# EAGLE design layout_2layers (EAGLE 7.7.0)
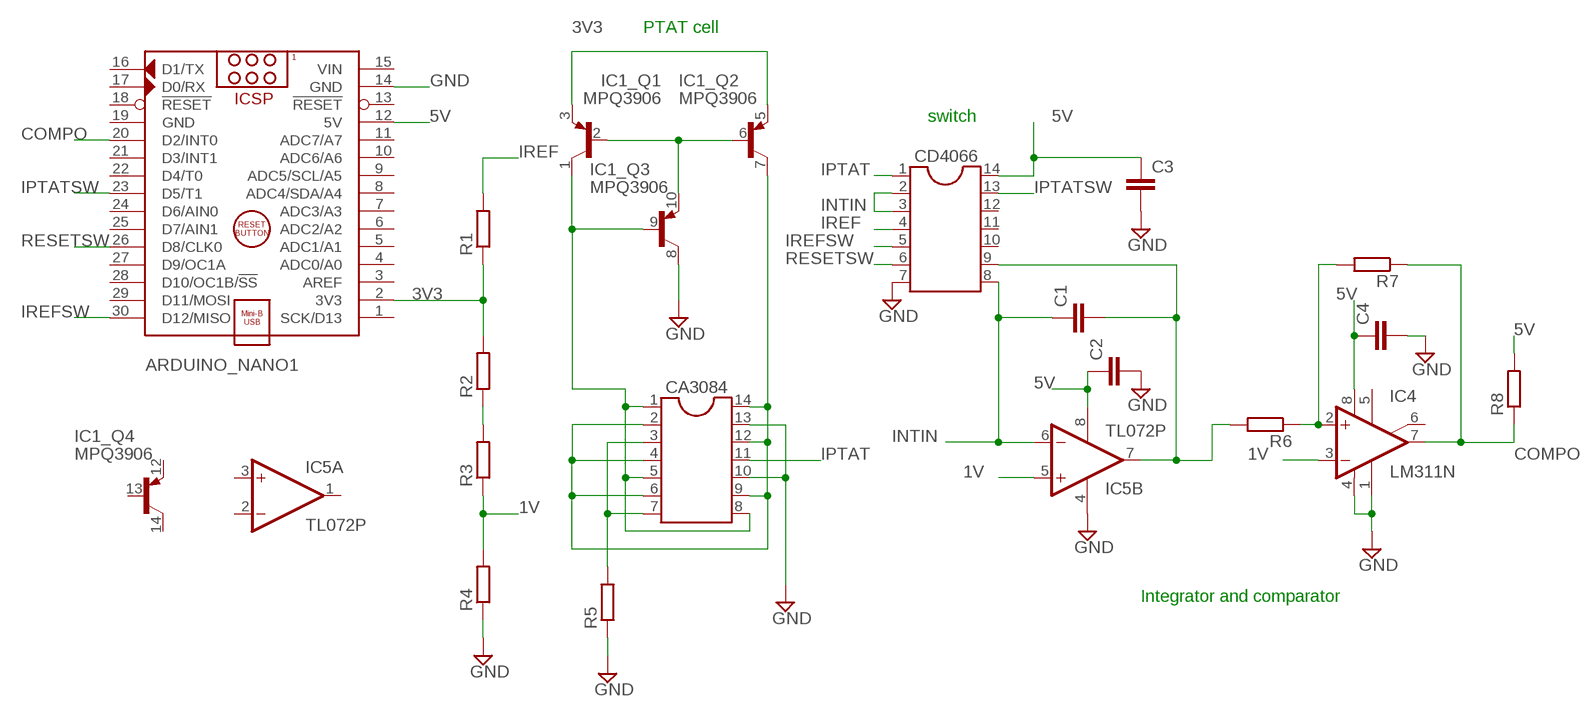
[diagram p0: schematic, sheet 1]

## Parts
ARDUINO_NANO1  ARDUINO_NANO  [ARDUINO_NANO]
C1  C-EU050-025X075  [C050-025X075]
C2  C-EU050-025X075  [C050-025X075]
C3  C-EU050-025X075  [C050-025X075]
C4  C-EU050-025X075  [C050-025X075]
CA3084  DIL14S  [SOCKET-14]
CD4066  DIL14S  [SOCKET-14]
IC1  MPQ3906  [DIL14]
IC4  LM311N  [DIL08]
IC5  TL072P  [DIL08]
R1  R-EU_0207/10  [0207/10]
R2  R-EU_0207/10  [0207/10]
R3  R-EU_0207/10  [0207/10]
R4  R-EU_0207/10  [0207/10]
R5  R-EU_0207/10  [0207/10]
R6  R-EU_0207/10  [0207/10]
R7  R-EU_0207/10  [0207/10]
R8  R-EU_0207/10  [0207/10]

## Nets
1V: IC4.3(-IN) IC5.5(B:+IN) R3.1 R4.2
3V3: ARDUINO_NANO1.2(3V3) IC1.3(_Q1:E) IC1.5(_Q2:E) R1.1 R2.2
5V: ARDUINO_NANO1.12(5V) C2.1 C3.1 C4.1 CD4066.14 IC4.8(V+) IC5.8(P:V+) R8.2
COMPO: ARDUINO_NANO1.20(D2/INT0) IC4.7(OUT) R7.1 R8.1
GND: ARDUINO_NANO1.14(GND) C2.2 C3.2 C4.2 CA3084.10 CA3084.13 CD4066.7 IC1.8(_Q3:C) IC4.1(GND) IC4.4(V-) IC5.4(P:V-) R4.1 R5.1
INTIN: C1.1 CD4066.2 CD4066.3 CD4066.8 IC5.6(B:-IN)
IPTAT: CA3084.11 CD4066.1
IPTATSW: ARDUINO_NANO1.23(D5/T1) CD4066.13
IREF: CD4066.4 R1.2
IREFSW: ARDUINO_NANO1.30(D12/MISO) CD4066.5
N$1: CA3084.3 CA3084.7 R5.2
N$2: CA3084.2 CA3084.4 CA3084.6 CA3084.9 CA3084.12 CA3084.14 IC1.7(_Q2:C)
N$3: IC4.2(+IN) R6.1 R7.2
N$5: R2.1 R3.2
N$7: IC1.2(_Q1:B) IC1.6(_Q2:B) IC1.10(_Q3:E)
N$12: CA3084.1 CA3084.5 CA3084.8 IC1.1(_Q1:C) IC1.9(_Q3:B)
RESET2: C1.2 CD4066.9 IC5.7(B:OUT) R6.2
RESETSW: ARDUINO_NANO1.26(D8/CLK0) CD4066.6
Unconnected: ARDUINO_NANO1.1(SCK/D13) ARDUINO_NANO1.3(AREF) ARDUINO_NANO1.4(ADC0/A0) ARDUINO_NANO1.5(ADC1/A1) ARDUINO_NANO1.6(ADC2/A2) ARDUINO_NANO1.7(ADC3/A3) ARDUINO_NANO1.8(ADC4/SDA/A4) ARDUINO_NANO1.9(ADC5/SCL/A5) ARDUINO_NANO1.10(ADC6/A6) ARDUINO_NANO1.11(ADC7/A7) ARDUINO_NANO1.13(!RESET) ARDUINO_NANO1.16(D1/TX) ARDUINO_NANO1.17(D0/RX) ARDUINO_NANO1.18(!RESET) ARDUINO_NANO1.21(D3/INT1) ARDUINO_NANO1.22(D4/T0) ARDUINO_NANO1.24(D6/AIN0) ARDUINO_NANO1.25(D7/AIN1) ARDUINO_NANO1.27(D9/OC1A) ARDUINO_NANO1.28(D10/OC1B/!SS) ARDUINO_NANO1.29(D11/MOSI) CD4066.10 CD4066.11 CD4066.12 IC1.12(_Q4:E) IC1.13(_Q4:B) IC1.14(_Q4:C) IC4.5(ON) IC4.6(ON/STR) IC5.1(A:OUT) IC5.2(A:-IN) IC5.3(A:+IN)

## Notes on the sheet
- PTAT cell
- switch
- Integrator and comparator

## Power pins joined to a net without a drawn wire
GND: ARDUINO_NANO1.19(GND)
VIN: ARDUINO_NANO1.15(VIN)

## Library data of the parts
ARDUINO_NANO1 = 6301-temp-sensor-rev1:ARDUINO_NANO: Arduino Nano V3.0 Module Overview: The Arduino Nano is a small, complete, and breadboard-friendly board based on the ATmega328 (Arduino Nano 3.x) or ATmega168 (Arduino Nano 2.x). It has more or less the same functionality of the Arduino Duemilanove, but in a different package. It lacks only a DC power jack, and works with a Mini-B USB cable instead of a standard one. The Nano was designed and is being produced by Gravitech <http://www.gravitech.us/arna30wiatp.html>. General specifications: Item Value Microcontroller Atmel ATmega168 or ATmega328 Operating Voltage (logic level) 5 V Input Voltage (recommended) 7-12 V Input Voltage (limits) 6-20 V Digital I/O Pins 14 (of which 6 provide PWM output) Analog Input Pins 8 DC Current per I/O Pin 40 mA Flash Memory 16 KB (ATmega168) or 32 KB (ATmega328) of which 2 KB used by bootloader SRAM 1 KB (ATmega168) or 2 KB (ATmega328) EEPROM 512 bytes (ATmega168) or 1 KB (ATmega328) Clock Speed 16 MHz Dimensions (Inches) 0.73" x 1.70" Dimensions (mm) 18mm x 45mm Overall height About 9 mm (not including pins) Weigth 5 g Power: The Arduino Nano can be powered via the Mini-B USB connection, 6-20V unregulated external power supply (pin 30), or 5V regulated external power supply (pin 27). The power source is automatically selected to the highest voltage source. Memory: The ATmega168 has 16 KB of flash memory for storing code (of which 2 KB is used for the bootloader); the ATmega328 has 32 KB, (also with 2 KB used for the bootloader). The ATmega168 has 1 KB of SRAM and 512 bytes of EEPROM (which can be read and written with the EEPROM library); the ATmega328 has 2 KB of SRAM and 1 KB of EEPROM. Input and Output: Each of the 14 digital pins on the Nano can be used as an input or output, using pinMode(), digitalWrite(), and digitalRead() functions. They operate at 5 volts. Each pin can provide or receive a maximum of 40 mA and has an internal pull-up resistor (disconnected by default) of 20-50 kOhms. In addition, some pins have specialized functions. Visit Arduino - ArduinoBoardNano <https://www.arduino.cc/en/Main/ArduinoBoardNano>
C1-C4 = rcl:C-EU: CAPACITOR, European symbol; C1: 1u
CA3084 CD4066 = ic-package:DIL14: Dual In Line / Socket
IC1 = 6301-temp-sensor-rev1:MPQ3906
IC4 = 6301-temp-sensor-rev1:LM311: COMPARATOR
IC5 = 6301-temp-sensor-rev1:TL072: OP AMP
R1-R8 = resistor:R-EU_: RESISTOR, European symbol

## Net classes
0 default: clearance 0.406 mm

## Board
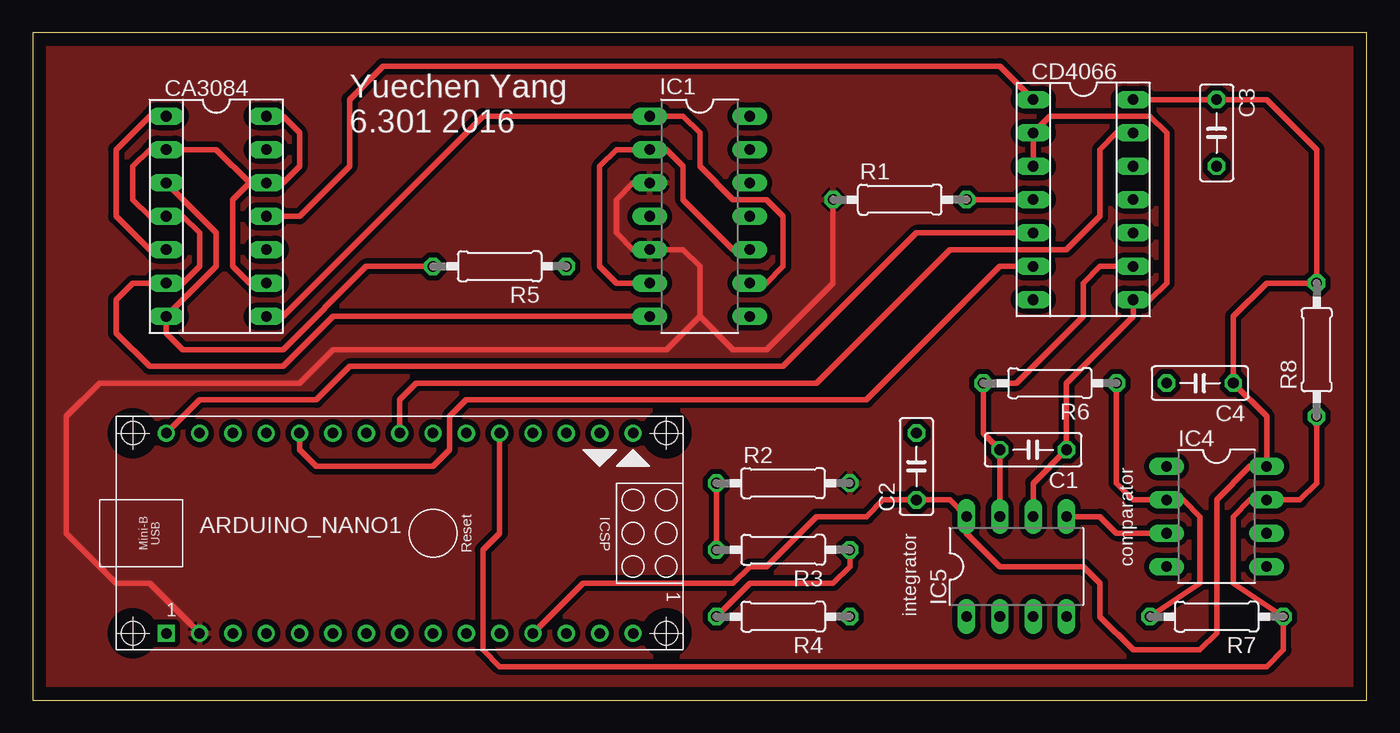
[diagram p1: board, top side]
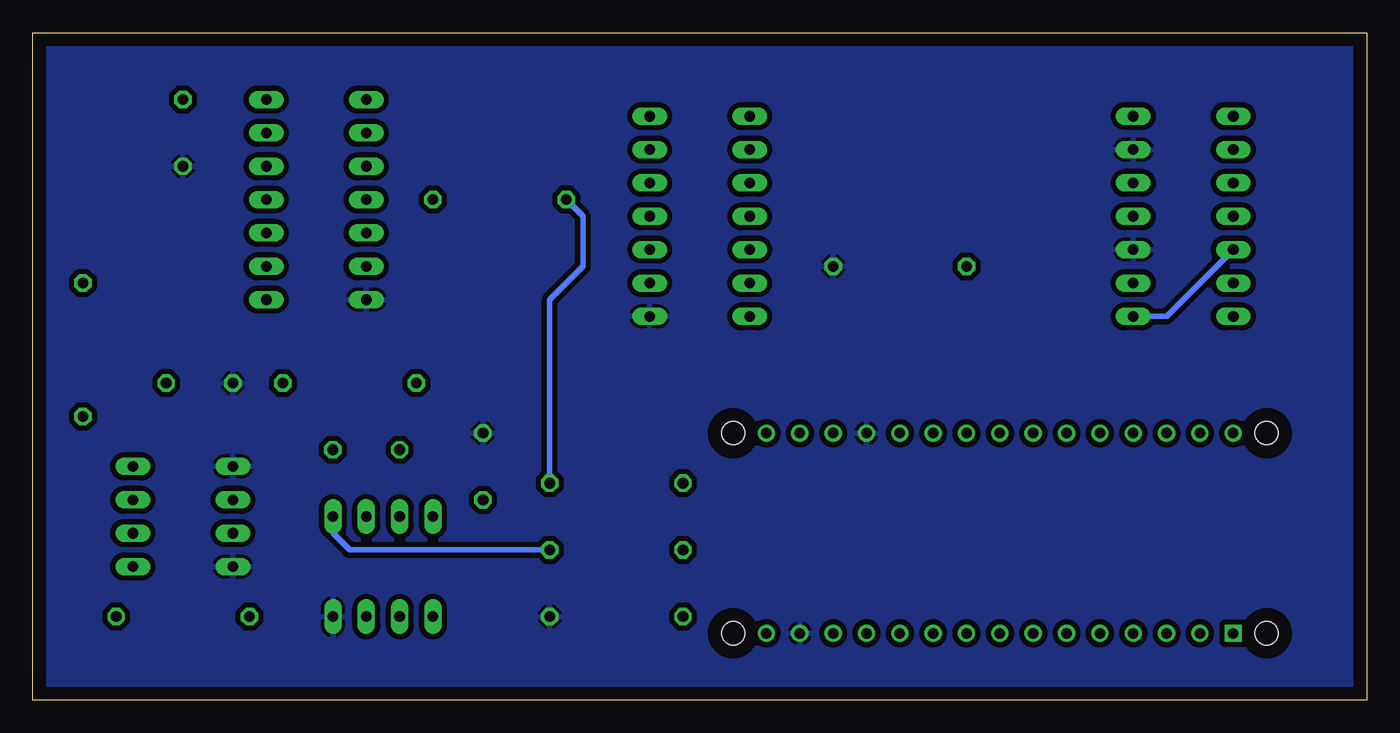
[diagram p2: board, bottom side, seen from below]

Size 101.6 x 50.8 mm. Coordinates in mm from the lower left corner, seen from the top.
Outline: 101.6,0 101.6,50.8 0,50.8 0,0 101.6,0
Copper layers (1*16): Top 0.035mm / dielectric 1.5mm / Bottom 0.035mm
Design rules "default *": minimum track width 12mil, minimum drill 24mil, track to track 16mil, track to pad 16mil, pad to pad 16mil, via to via 16mil, smd to smd 16mil, copper to edge 40mil, drill to drill 8mil, minimum pad ring 10mil, minimum via ring 8mil, stop-mask expansion 4mil, vias tented up to drill 0mil, thermal gap 10mil

### Footprints (pad centres in the part's own frame; a part is rotated, then mirrored left to right if it is on the bottom)
ARDUINO_NANO = drill 0.8 square: 1 -20.32,-7.62 | drill 0.8: 2 -17.78,-7.62; 3 -15.24,-7.62; 4 -12.7,-7.62; 5 -10.16,-7.62; 6 -7.62,-7.62; 7 -5.08,-7.62; 8 -2.54,-7.62; 9 0,-7.62; 10 2.54,-7.62; 11 5.08,-7.62; 12 7.62,-7.62; 13 10.16,-7.62; 14 12.7,-7.62; 15 15.24,-7.62; 16 15.24,7.62; 17 12.7,7.62; 18 10.16,7.62; 19 7.62,7.62; 20 5.08,7.62; 21 2.54,7.62; 22 0,7.62; 23 -2.54,7.62; 24 -5.08,7.62; 25 -7.62,7.62; 26 -10.16,7.62; 27 -12.7,7.62; 28 -15.24,7.62; 29 -17.78,7.62; 30 -20.32,7.62 | hole 1.778: -22.86,-7.62; -22.86,7.62; 17.78,7.62; 17.78,-7.62
C050-025X075 = drill 0.813 octagon: 1 -2.54,0; 2 2.54,0
SOCKET-14 = drill 0.813 long: 1 -7.62,-3.81; 2 -5.08,-3.81; 3 -2.54,-3.81; 4 0,-3.81; 5 2.54,-3.81; 6 5.08,-3.81; 7 7.62,-3.81; 8 7.62,3.81; 9 5.08,3.81; 10 2.54,3.81; 11 0,3.81; 12 -2.54,3.81; 13 -5.08,3.81; 14 -7.62,3.81
DIL14 = drill 0.813 long: 1 -7.62,-3.81; 2 -5.08,-3.81; 3 -2.54,-3.81; 4 0,-3.81; 5 2.54,-3.81; 6 5.08,-3.81; 7 7.62,-3.81; 8 7.62,3.81; 9 5.08,3.81; 10 2.54,3.81; 11 0,3.81; 12 -2.54,3.81; 13 -5.08,3.81; 14 -7.62,3.81
DIL08 = drill 0.813 long: 1 -3.81,-3.81; 2 -1.27,-3.81; 3 1.27,-3.81; 4 3.81,-3.81; 5 3.81,3.81; 6 1.27,3.81; 7 -1.27,3.81; 8 -3.81,3.81
0207/10 = drill 0.813 octagon: 1 -5.08,0; 2 5.08,0

### Placement (x,y rotation side)
ARDUINO_NANO1  30.48,12.7 0 top
C1  76.2,19.05 180 top
C2  67.31,17.78 90 top
C3  90.17,43.18 270 top
C4  88.9,24.13 180 top
CA3084  13.97,36.83 270 top
CD4066  80.01,38.1 270 top
IC1  50.8,36.83 270 top
IC4  90.17,13.97 270 top
IC5  74.93,10.16 0 top
R1  66.04,38.1 0 top
R2  57.15,16.51 0 top
R3  57.15,11.43 180 top
R4  57.15,6.35 180 top
R5  35.56,33.02 180 top
R6  77.47,24.13 180 top
R7  90.17,6.35 180 top
R8  97.79,26.67 90 top

### Tracks (layer width: path | path; a pad name or v marks a point on that pad's centre or on a via)
1V
  Top 0.406: R3.1 62.23,10.16 60.96,8.89 54.61,8.89 R4.2 | IC5.5 81.28,13.97 82.55,12.7 IC4.3
  Bottom 0.406: IC5.5 78.74,12.7 77.47,11.43 R3.1
3V3
  Top 0.406: IC1.3 45.72,39.37 44.45,38.1 44.45,35.56 45.72,34.29 IC1.5 49.53,34.29 50.8,33.02 50.8,29.21 | ARDUINO_NANO1.2 8.89,8.89 6.35,8.89 2.54,12.7 2.54,21.59 5.08,24.13 20.32,24.13 22.86,26.67 48.26,26.67 50.8,29.21 | R1.1 60.96,31.75 55.88,26.67 53.34,26.67 50.8,29.21
  Bottom 0.406: R2.2 62.23,30.48 59.69,33.02 59.69,36.83 R1.1
  pour Top: 0,50.8 0,0 101.6,0 101.6,50.8
5V
  Top 0.406: CD4066.14 C3.1 93.98,45.72 97.79,41.91 R8.2 93.98,31.75 91.44,29.21 C4.1 93.98,21.59 IC4.8 92.71,17.78 90.17,15.24 90.17,5.08 88.9,3.81 83.82,3.81 81.28,6.35 81.28,8.89 80.01,10.16 73.66,10.16 71.12,12.7 IC5.8 69.85,15.24 C2.1 64.77,15.24 63.5,13.97 59.69,13.97 55.88,10.16 54.61,10.16 53.34,8.89 41.91,8.89 ARDUINO_NANO1.12
COMPO
  Top 0.406: R8.1 97.79,16.51 96.52,15.24 IC4.7 92.71,15.24 91.44,13.97 91.44,8.89 R7.1 95.25,3.81 93.98,2.54 35.56,2.54 34.29,3.81 34.29,11.43 35.56,12.7 ARDUINO_NANO1.20
GND
  pour Bottom: 0,50.8 0,0 101.6,0 101.6,50.8
INTIN
  Top 0.406: IC5.6 76.2,16.51 C1.1 78.74,24.13 83.82,29.21 CD4066.8 85.09,30.48 86.36,31.75 86.36,43.18 85.09,44.45 77.47,44.45 CD4066.2 CD4066.3
IPTAT
  Top 0.406: CD4066.1 73.66,48.26 26.67,48.26 24.13,45.72 24.13,40.64 20.32,36.83 CA3084.11
IPTATSW
  Top 0.406: CD4066.13 82.55,43.18 81.28,41.91 81.28,36.83 78.74,34.29 69.85,34.29 59.69,24.13 29.21,24.13 27.94,22.86 ARDUINO_NANO1.23
IREF
  Top 0.406: R1.2 CD4066.4
IREFSW
  Top 0.406: CD4066.5 67.31,35.56 57.15,25.4 24.13,25.4 21.59,22.86 12.7,22.86 ARDUINO_NANO1.30
N$1
  Top 0.406: CA3084.3 13.97,35.56 13.97,33.02 CA3084.7 10.16,27.94 11.43,26.67 19.05,26.67 25.4,33.02 R5.2
N$2
  Top 0.406: CA3084.14 19.05,44.45 20.32,43.18 20.32,40.64 19.05,39.37 CA3084.12 16.51,39.37 | 16.51,39.37 13.97,41.91 CA3084.2 8.89,41.91 7.62,40.64 7.62,38.1 8.89,36.83 CA3084.4 11.43,36.83 12.7,35.56 12.7,33.02 11.43,31.75 CA3084.6 7.62,31.75 6.35,30.48 6.35,27.94 8.89,25.4 19.05,25.4 22.86,29.21 IC1.7 | CA3084.9 16.51,31.75 15.24,33.02 15.24,38.1 16.51,39.37
N$3
  Top 0.406: R7.2 88.9,8.89 88.9,13.97 87.63,15.24 IC4.2 83.82,15.24 82.55,16.51 R6.1
N$5
  Top 0.406: R2.1 R3.2
N$7
  Top 0.406: IC1.6 44.45,31.75 43.18,33.02 43.18,40.64 44.45,41.91 IC1.2 48.26,41.91 49.53,40.64 49.53,38.1 53.34,34.29 IC1.10
N$12
  Top 0.406: IC1.9 55.88,31.75 57.15,33.02 57.15,36.83 55.88,38.1 53.34,38.1 50.8,40.64 50.8,43.18 49.53,44.45 IC1.1 34.29,44.45 19.05,29.21 CA3084.8 | CA3084.1 8.89,44.45 6.35,41.91 6.35,36.83 8.89,34.29 CA3084.5
  Bottom 0.406: CA3084.8 15.24,29.21 CA3084.5
RESET2
  Top 0.406: CD4066.9 81.28,33.02 80.01,31.75 80.01,29.21 74.93,24.13 R6.2 72.39,20.32 C1.2 IC5.7
RESETSW
  Top 0.406: CD4066.6 73.66,33.02 63.5,22.86 33.02,22.86 31.75,21.59 31.75,19.05 30.48,17.78 21.59,17.78 20.32,19.05 ARDUINO_NANO1.26

### Text on the board
tNames: Yuechen Yang / 6.301 2016 | comparator | integrator